# EAGLE design mic-preamp-stereo2 (EAGLE 6.2)
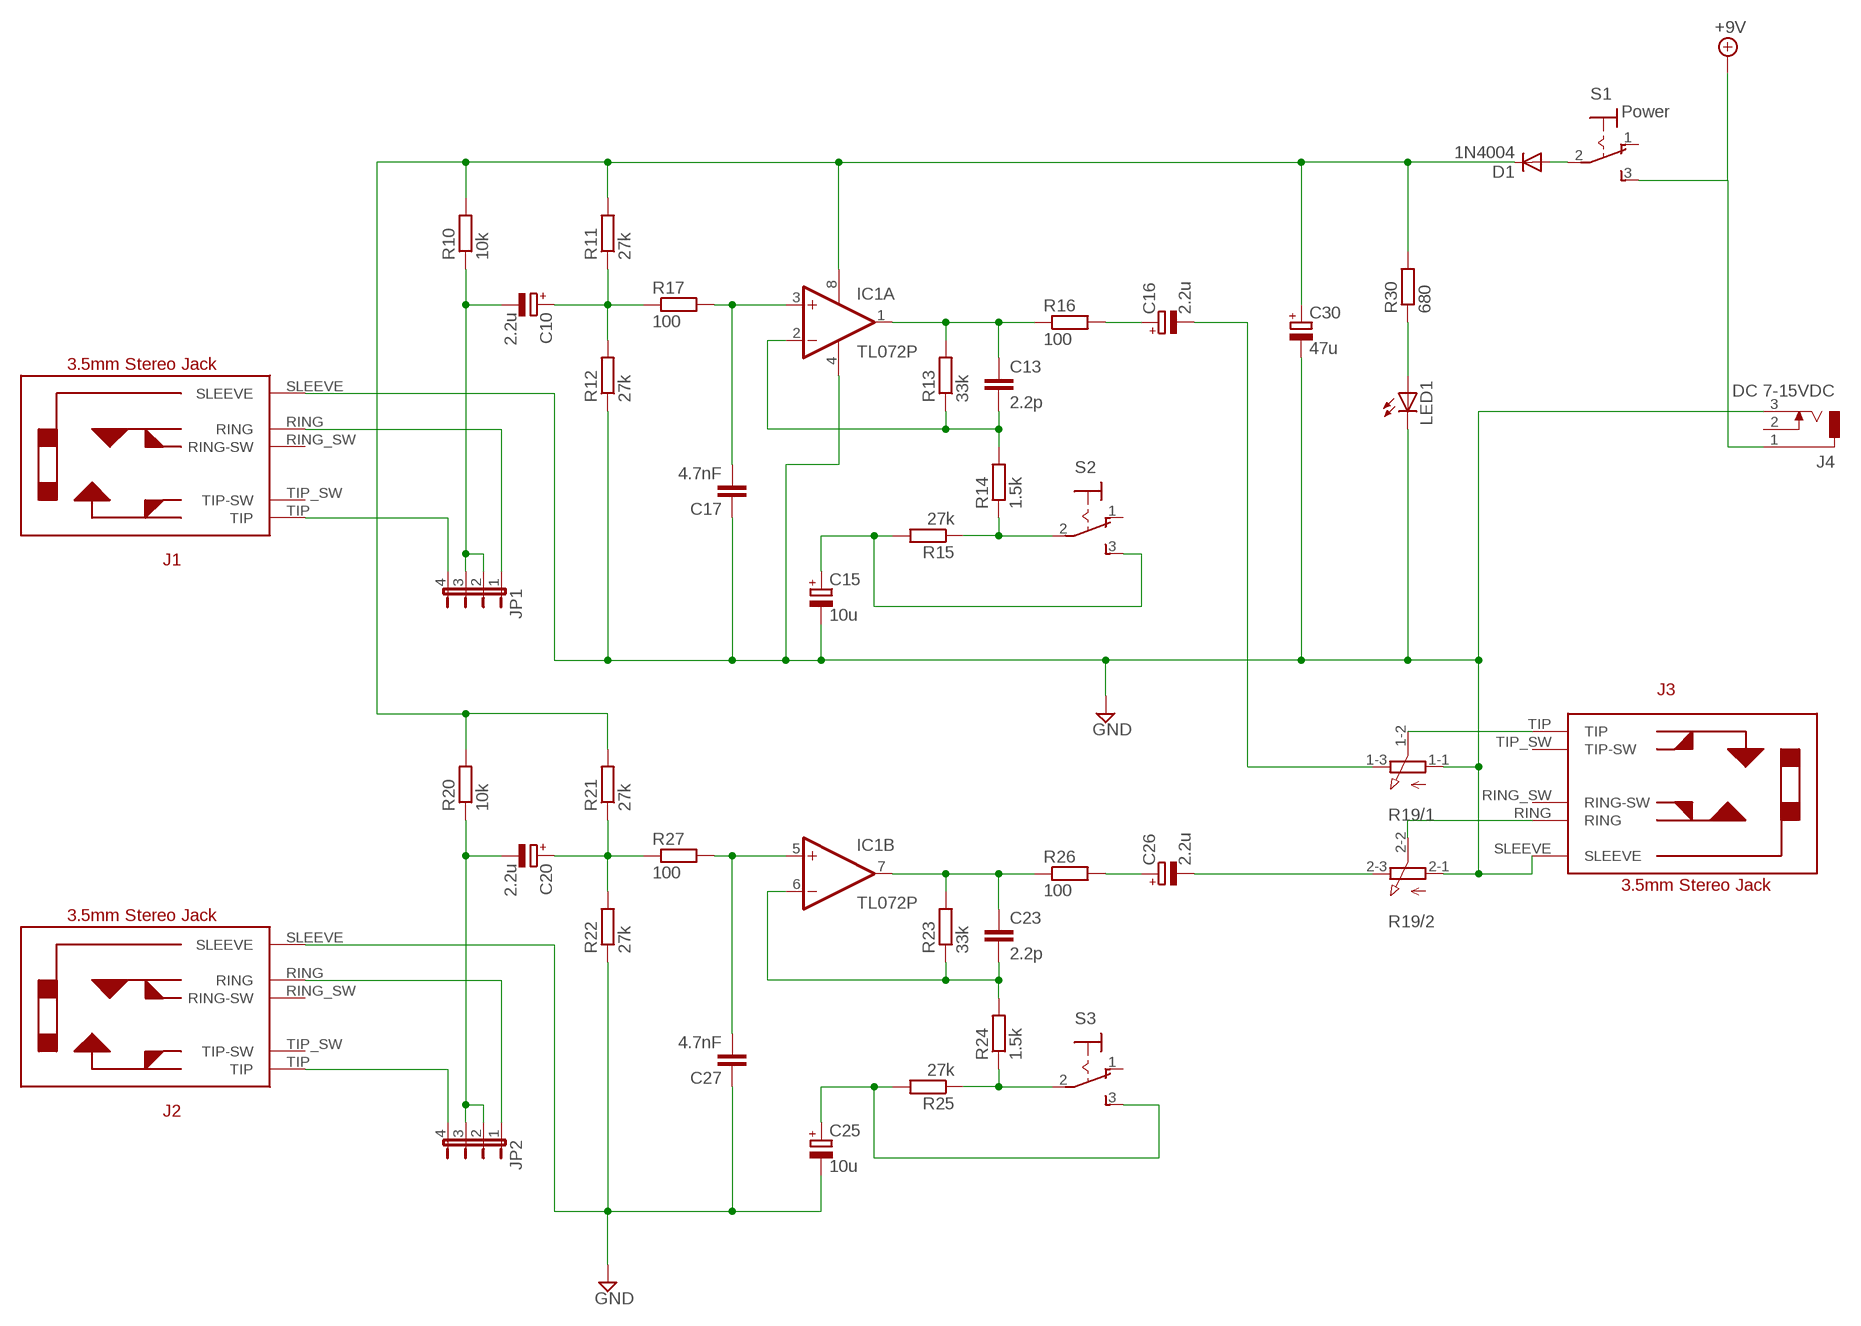
[diagram p0: schematic, sheet 1]

## Parts
C10  2.2u  CPOL-EUE2-5  [E2-5]
C13  2.2p  C-EU025-024X044  [C025-024X044]
C15  10u  CPOL-EUE2-5  [E2-5]
C16  2.2u  CPOL-EUE2-5  [E2-5]
C17  4.7nF  C-EU025-024X044  [C025-024X044]
C20  2.2u  CPOL-EUE2-5  [E2-5]
C23  2.2p  C-EU025-024X044  [C025-024X044]
C25  10u  CPOL-EUE2-5  [E2-5]
C26  2.2u  CPOL-EUE2-5  [E2-5]
C27  4.7nF  C-EU025-024X044  [C025-024X044]
C30  47u  CPOL-EUE2-5  [E2-5]
D1  1N4004  [DO41-10]
IC1  TL072P  [DIL08]
J1  PICAXE_STEREOJACKSOCKET  [PICAXE_STEREOJACKSOCKET]
J2  PICAXE_STEREOJACKSOCKET  [PICAXE_STEREOJACKSOCKET]
J3  Stereo Out  PICAXE_STEREOJACKSOCKET  [PICAXE_STEREOJACKSOCKET]
J4  DC 7-15VDC  DCJ0202  [DCJ0202]
JP1  JP4E  [JP4]
JP2  JP4E  [JP4]
LED1  LED5MM  [LED5MM]
R10  10k  R-EU_0207/5V  [0207/5V]
R11  27k  R-EU_0207/5V  [0207/5V]
R12  27k  R-EU_0207/5V  [0207/5V]
R13  33k  R-EU_0207/5V  [0207/5V]
R14  1.5k  R-EU_0207/5V  [0207/5V]
R15  27k  R-EU_0207/5V  [0207/5V]
R16  100  R-EU_0207/5V  [0207/5V]
R17  100  R-EU_0207/5V  [0207/5V]
R19  3RP/1610G  [3RP/1610G]
R20  10k  R-EU_0207/5V  [0207/5V]
R21  27k  R-EU_0207/5V  [0207/5V]
R22  27k  R-EU_0207/5V  [0207/5V]
R23  33k  R-EU_0207/5V  [0207/5V]
R24  1.5k  R-EU_0207/5V  [0207/5V]
R25  27k  R-EU_0207/5V  [0207/5V]
R26  100  R-EU_0207/5V  [0207/5V]
R27  100  R-EU_0207/5V  [0207/5V]
R30  680  R-EU_0207/12  [0207/12]
S1  Power  M9040P  [M9040P]
S2  M9040P  [M9040P]
S3  M9040P  [M9040P]

## Nets
+9V: J4.1 S1.3(S)
GND [Ground]: C15.- C17.1 C25.- C27.1 C30.- IC1.4(P:V-) J1.SLEEVE J2.SLEEVE J3.SLEEVE J4.3 LED1.K(C) R12.1 R19.1-1(/1:A) R19.2-1(/2:A) R22.1
N$1: C10.+ R11.1 R12.2 R17.1
N$2: C13.1 IC1.1(A:OUT) R13.2 R16.1
N$3: C13.2 IC1.2(A:-IN) R13.1 R14.2
N$4: C30.+ D1.C IC1.8(P:V+) R10.2 R11.2 R20.2 R21.2 R30.2
N$5: R14.1 R15.1 S2.2(P)
N$6: C16.+ R16.2
N$7: C10.- JP1.2 JP1.3 R10.1
N$8: D1.A S1.2(P)
N$9: C15.+ R15.2 S2.3(S)
N$10: C16.- R19.1-3(/1:E)
N$11: LED1.A R30.1
N$12: C20.+ R21.1 R22.2 R27.1
N$13: C26.- R19.2-3(/2:E)
N$14: J1.TIP JP1.4
N$15: J1.RING JP1.1
N$16: C23.1 IC1.7(B:OUT) R23.2 R26.1
N$17: C23.2 IC1.6(B:-IN) R23.1 R24.2
N$18: J3.RING R19.2-2(/2:S)
N$19: R24.1 R25.1 S3.2(P)
N$20: C26.+ R26.2
N$21: C20.- JP2.2 JP2.3 R20.1
N$22: C25.+ R25.2 S3.3(S)
N$23: J3.TIP R19.1-2(/1:S)
N$24: C17.2 IC1.3(A:+IN) R17.2
N$25: J2.TIP JP2.4
N$26: J2.RING JP2.1
N$27: C27.2 IC1.5(B:+IN) R27.2
Unconnected: J1.RING_SW(RING-SW) J1.TIP_SW(TIP-SW) J2.RING_SW(RING-SW) J2.TIP_SW(TIP-SW) J3.RING_SW(RING-SW) J3.TIP_SW(TIP-SW) J4.2 S1.1(O) S2.1(O) S3.1(O)

## Library data of the parts
C10 C15 C16 C20 C25 C26 C30 = rcl:CPOL-EU: POLARIZED CAPACITOR, European symbol
C13 C17 C23 C27 = rcl:C-EU: CAPACITOR, European symbol
D1 = diode:1N4004: DIODE general purpose rectifier, 1 A
IC1 = linear:TL072: OP AMP
J1-J3 = PICAXE_StereoJackSocket:PICAXE_STEREOJACKSOCKET
J4 = con-jack:DCJ0202: DC POWER JACK Source: DCJ0202.pdf; OC_FARNELL: unknown; OC_NEWARK: unknown
JP1 JP2 = jumper:JP4E: JUMPER
LED1 = led:LED: LED OSRAM: - CHIPLED LG R971, LG N971, LY N971, LG Q971, LY Q971, LO R971, LY R971 LH N974, LH R974 LS Q976, LO Q976, LY Q976 LO Q996 - Hyper CHIPLED LW Q18S LB Q993, LB Q99A, LB R99A - SideLED LS A670, LO A670, LY A670, LG A670, LP A670 LB A673, LV A673, LT A673, LW A673 LH A674 LY A675 LS A676, LA A676, LO A676, LY A676, LW A676 LS A679, LY A679, LG A679 - Hyper Micro SIDELED® LS Y876, LA Y876, LO Y876, LY Y876 LT Y87S - SmartLED LW L88C, LW L88S LB L89C, LB L89S, LG L890 LS L89K, LO L89K, LY L89K LS L896, LA L896, LO L896, LY L896 - TOPLED LS T670, LO T670, LY T670, LG T670, LP T670 LSG T670, LSP T670, LSY T670, LOP T670, LYG T670 LG T671, LOG T671, LSG T671 LB T673, LV T673, LT T673, LW T673 LH T674 LS T676, LA T676, LO T676, LY T676, LB T676, LH T676, LSB T676, LW T676 LB T67C, LV T67C, LT T67C, LS T67K, LO T67K, LY T67K, LW E67C LS E67B, LA E67B, LO E67B, LY E67B, LB E67C, LV E67C, LT E67C LW T67C LS T679, LY T679, LG T679 LS T770, LO T770, LY T770, LG T770, LP T770 LB T773, LV T773, LT T773, LW T773 LH T774 LS E675, LA E675, LY E675, LS T675 LS T776, LA T776, LO T776, LY T776, LB T776 LHGB T686 LT T68C, LB T68C - Hyper Mini TOPLED® LB M676 - Mini TOPLED Santana® LG M470 LS M47K, LO M47K, LY M47K Source: http://www.osram.convergy.de LUXEON: - LUMILED® LXK2-PW12-R00, LXK2-PW12-S00, LXK2-PW14-U00, LXK2-PW14-V00 LXK2-PM12-R00, LXK2-PM12-S00, LXK2-PM14-U00 LXK2-PE12-Q00, LXK2-PE12-R00, LXK2-PE12-S00, LXK2-PE14-T00, LXK2-PE14-U00 LXK2-PB12-K00, LXK2-PB12-L00, LXK2-PB12-M00, LXK2-PB14-N00, LXK2-PB14-P00, LXK2-PB14-Q00 LXK2-PR12-L00, LXK2-PR12-M00, LXK2-PR14-Q00, LXK2-PR14-R00 LXK2-PD12-Q00, LXK2-PD12-R00, LXK2-PD12-S00 LXK2-PH12-R00, LXK2-PH12-S00 LXK2-PL12-P00, LXK2-PL12-Q00, LXK2-PL12-R00 Source: www.luxeon.com KINGBRIGHT: KA-3528ASYC Source: www.kingbright.com
R10-R16 R20-R26 R30 = rcl:R-EU_: RESISTOR, European symbol
R17 R27 = resistor:R-EU_: RESISTOR, European symbol
R19 = pot:3RP/1610G: 16mm Potentiometer two level Source: http://www.alphapotentiometers.net/html/16mm_pot_2.html
S1-S3 = switch:M9040P: TOGGLE SWITCH Marquardt

## Net classes
0 default: width 0.381 mm
1 Ground: width 0.305 mm, clearance 0.229 mm

## Board
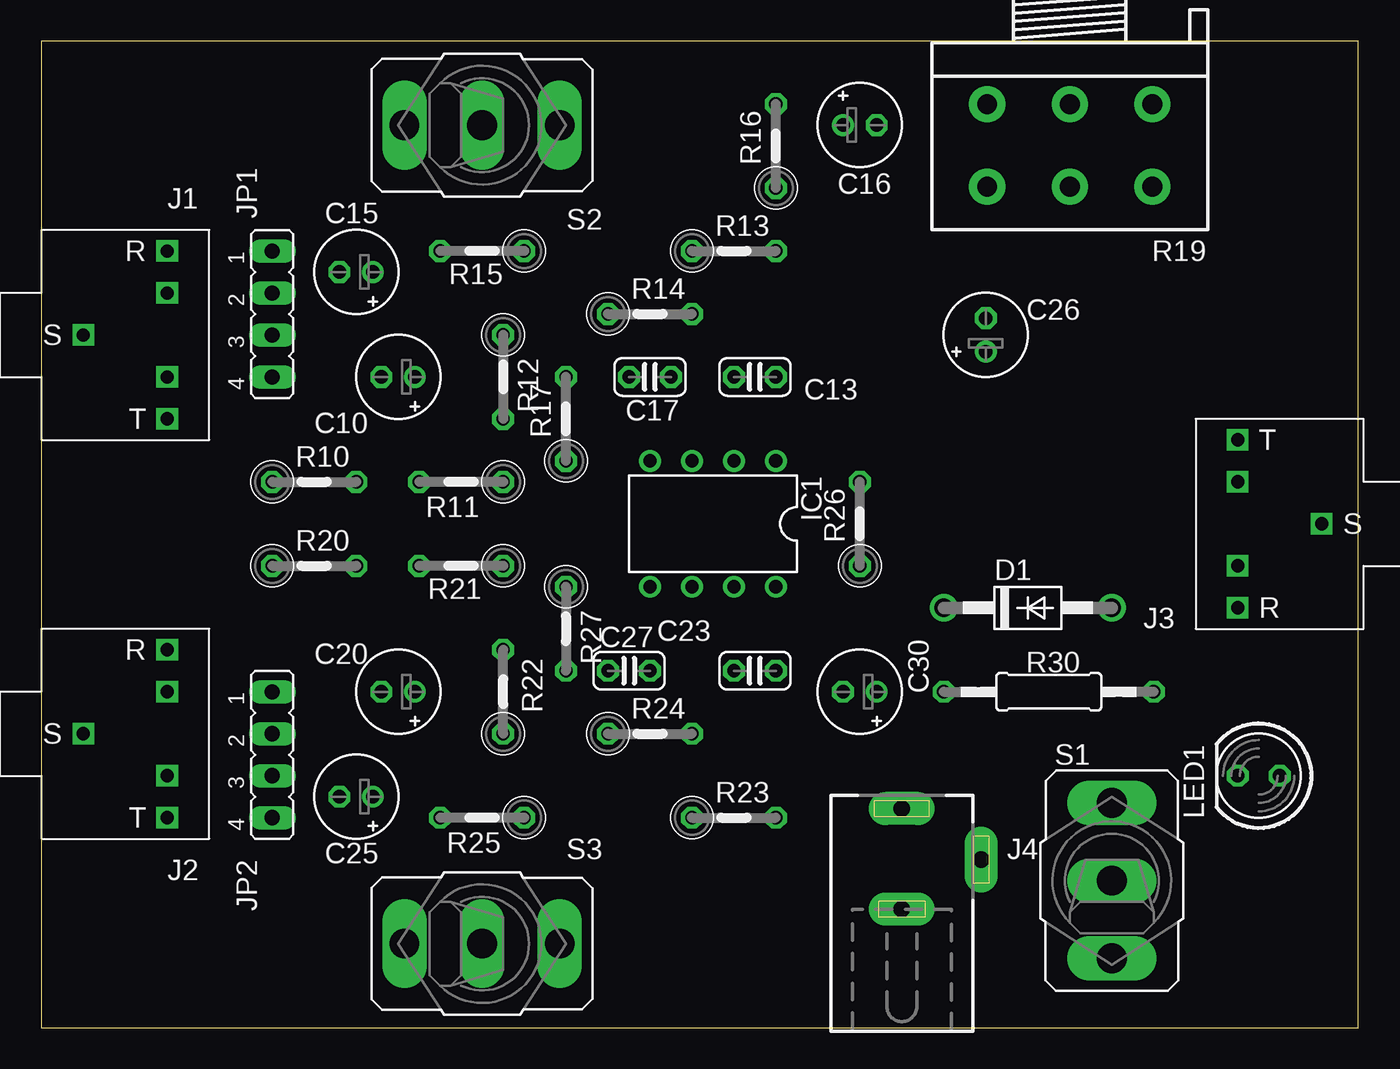
[diagram p1: board, top side]
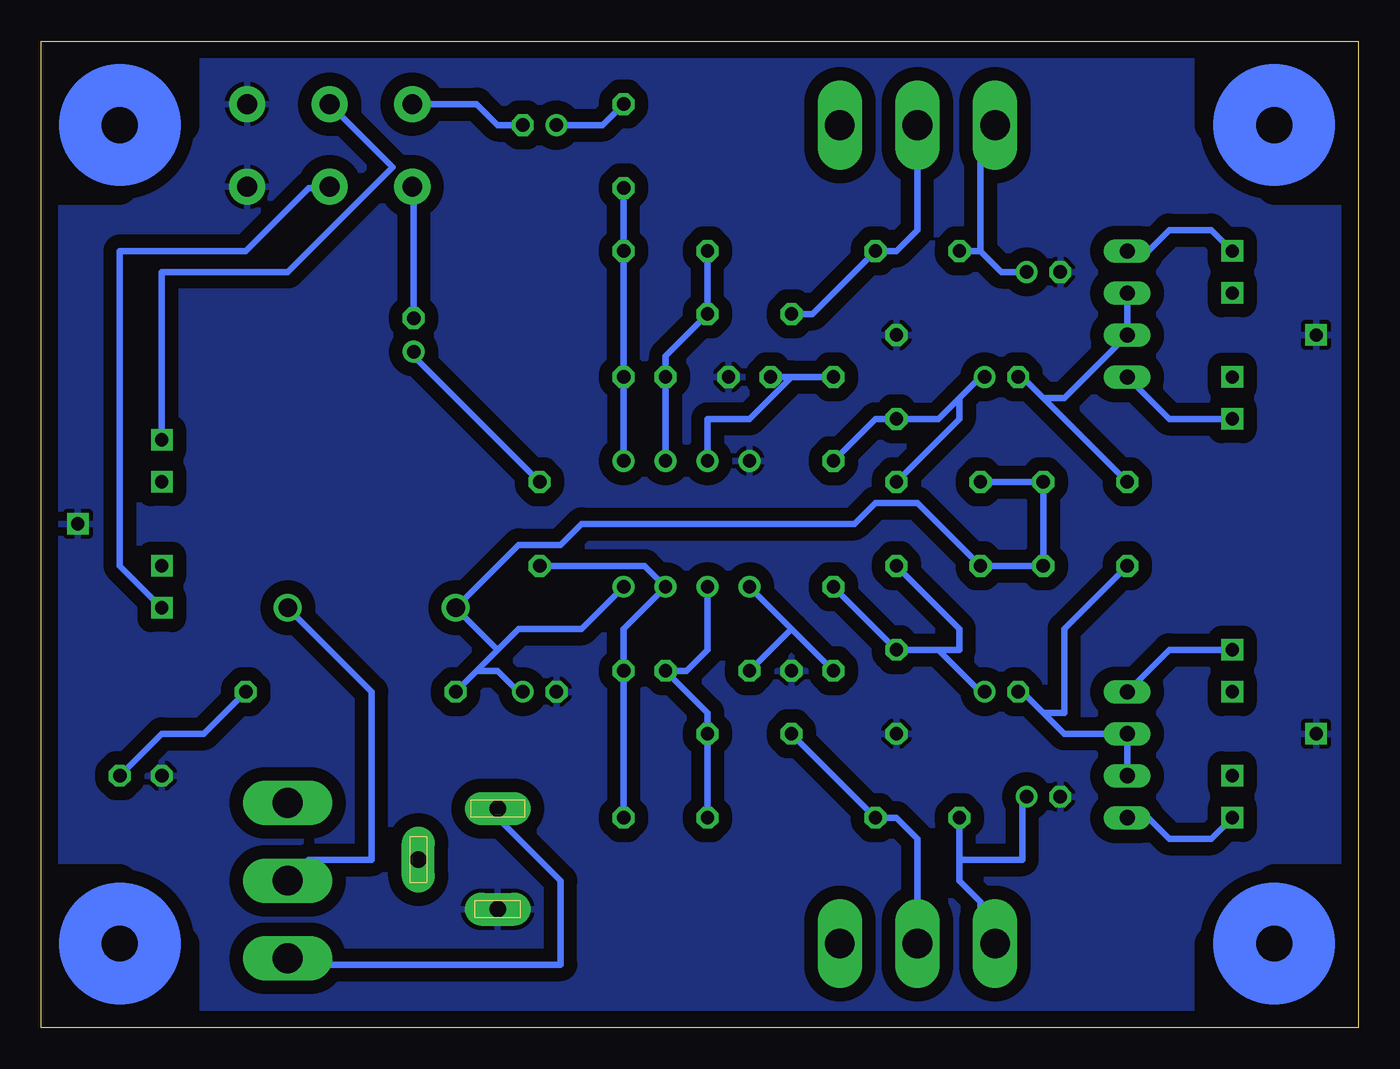
[diagram p2: board, bottom side, seen from below]

Size 79.68 x 59.68 mm. Coordinates in mm from the lower left corner, seen from the top.
Outline: 0,0 79.68,0 79.68,59.68 0,59.68 0,0
Copper layers 16: Bottom 0.035mm
Design rules: minimum track width 10mil, minimum drill 0.3mm, track to track 10mil, track to pad 10mil, pad to pad 10mil, via to via 10mil, smd to smd 10mil, copper to edge 40mil, drill to drill 8mil, minimum pad ring 10mil, minimum via ring 8mil, stop-mask expansion 8mil, vias tented up to drill 0mil, thermal gap 10mil
bRestrict: area 10.2,61 to 69.8,63.5; area 10.2,-3.8 to 69.8,-1.3; area -2.5,7.6 to -1.3,50.8; area -2.5,50.8 to 8.9,62.2; area 71.1,50.8 to 82.5,63.5; area 71.1,-2.5 to 82.5,8.9; area -2.5,-2.5 to 8.9,8.9

### Footprints (pad centres in the part's own frame; a part is rotated, then mirrored left to right if it is on the bottom)
E2-5 = drill 0.813 pad 1.27: + -1.016,0 | drill 0.813 pad 1.27 octagon: - 1.016,0
C025-024X044 = drill 0.813 octagon: 1 -1.27,0; 2 1.27,0
DO41-10 = drill 1.118: A 5.08,0; C -5.08,0
DIL08 = drill 0.813 pad 1.27: 1 -3.81,-3.81; 2 -1.27,-3.81; 3 1.27,-3.81; 4 3.81,-3.81; 5 3.81,3.81; 6 1.27,3.81; 7 -1.27,3.81; 8 -3.81,3.81
PICAXE_STEREOJACKSOCKET = drill 0.8 square: RING -5.08,-5.08; RING_SW -5.08,-2.54; SLEEVE 0,0; TIP -5.08,5.08; TIP_SW -5.08,2.54
DCJ0202 = drill 1 pad 2 long: 1 0,3.1; 2 4.8,0; 3 0,-3
JP4 = drill 0.914 long: 1 -3.81,0; 2 -1.27,0; 3 1.27,0; 4 3.81,0
LED5MM = drill 0.813 octagon: A -1.27,0; K 1.27,0
0207/5V = drill 0.813 octagon: 1 -2.54,0; 2 2.54,0
3RP/1610G = drill 1.2 pad 2.184: 1-1 -5,0; 1-2 0,0; 1-3 5,0; 2-1 -5,5; 2-2 0,5; 2-3 5,5
0207/12 = drill 0.813 octagon: 1 -6.35,0; 2 6.35,0
M9040P = drill 1.803 long: 1 0,4.699; 2 0,0; 3 0,-4.699

### Placement (x,y rotation side)
C10  21.59,39.37 180 top
C13  43.18,39.37 180 top
C15  19.05,45.72 180 top
C16  49.53,54.61 0 top
C17  36.83,39.37 180 top
C20  21.59,20.32 180 top
C23  43.18,21.59 180 top
C25  19.05,13.97 180 top
C26  57.15,41.91 90 top
C27  35.56,21.59 0 top
C30  49.53,20.32 180 top
D1  59.69,25.4 0 top
IC1  40.64,30.48 180 top
J1  2.54,41.91 180 top
J2  2.54,17.78 180 top
J3  77.47,30.48 0 top
J4  52.07,10.16 0 top
JP1  13.97,43.18 270 top
JP2  13.97,16.51 270 top
LED1  73.66,15.24 180 top
R10  16.51,33.02 0 top
R11  25.4,33.02 180 top
R12  27.94,39.37 270 top
R13  41.91,46.99 0 top
R14  36.83,43.18 0 top
R15  26.67,46.99 180 top
R16  44.45,53.34 90 top
R17  31.75,36.83 90 top
R19  62.23,55.88 180 top
R20  16.51,27.94 0 top
R21  25.4,27.94 180 top
R22  27.94,20.32 90 top
R23  41.91,12.7 0 top
R24  36.83,17.78 0 top
R25  26.67,12.7 180 top
R26  49.53,30.48 90 top
R27  31.75,24.13 270 top
R30  60.96,20.32 180 top
S1  64.77,8.89 0 top
S2  26.67,54.61 270 top
S3  26.67,5.08 270 top

### Tracks (layer width: path | path; a pad name or v marks a point on that pad's centre or on a via)
+9V
  Bottom 0.381: J4.1 52.07,12.7 48.26,8.89 48.26,3.81 64.77,3.81 S1.3
GND
  pour Bottom (isolate 0.813): 0,59.69 80.01,59.69 80.01,0 0,0
N$1
  Bottom 0.381: 24.13,38.1 25.4,36.83 R12.2 29.21,36.83 R17.1 | 24.13,38.1 22.86,39.37 C10.+ | R11.1 24.13,36.83 24.13,38.1
N$2
  Bottom 0.381: IC1.1 C13.1 R13.2 R16.1
N$3
  Bottom 0.381: IC1.2 C13.2 41.91,40.64 R14.2 R13.1
N$4
  Bottom 0.381: R11.2 R10.2 R20.2 R21.2 26.67,31.75 29.21,31.75 30.48,30.48 46.99,30.48 48.26,29.21 50.8,29.21 D1.C 52.07,22.86 | 53.34,21.59 52.07,21.59 50.8,20.32 C30.+ | R30.2 53.34,21.59 | IC1.8 46.99,24.13 50.8,24.13 52.07,22.86 | 53.34,21.59 52.07,22.86
N$5
  Bottom 0.381: R14.1 33.02,43.18 R15.1 27.94,46.99 26.67,48.26 S2.2
N$6
  Bottom 0.381: R16.2 45.72,54.61 C16.+
N$7
  Bottom 0.381: JP1.2 JP1.3 17.78,38.1 19.05,38.1 | 19.05,38.1 20.32,39.37 C10.- | 19.05,38.1 R10.1
N$8
  Bottom 0.381: D1.A 59.69,20.32 59.69,10.16 63.5,10.16 S1.2
N$9
  Bottom 0.381: C15.+ 21.59,45.72 22.86,46.99 | R15.2 22.86,46.99 | 22.86,46.99 22.86,54.61 S2.3
N$10
  Bottom 0.381: C16.- 52.07,54.61 53.34,55.88 R19.1-3
N$11
  Bottom 0.381: R30.1 69.85,17.78 72.39,17.78 LED1.A
N$12
  Bottom 0.381: 25.4,22.86 22.86,20.32 C20.+ | 25.4,22.86 R22.2 R27.1 | R21.1 24.13,24.13 24.13,22.86 25.4,22.86
N$13
  Bottom 0.381: C26.- 57.15,50.8 R19.2-3
N$14
  Bottom 0.381: J1.TIP 11.43,36.83 JP1.4
N$15
  Bottom 0.381: J1.RING 8.89,48.26 11.43,48.26 12.7,46.99 JP1.1
N$16
  Bottom 0.381: R23.2 C23.1 44.45,24.13 IC1.7 43.18,27.94 R26.1
N$17
  Bottom 0.381: R23.1 R24.2 39.37,19.05 C23.2 40.64,21.59 39.37,22.86 IC1.6
N$18
  Bottom 0.381: J3.RING 74.93,27.94 74.93,46.99 67.31,46.99 63.5,50.8 62.23,50.8 R19.2-2
N$19
  Bottom 0.381: R24.1 R25.1 27.94,12.7 26.67,11.43 S3.2
N$20
  Bottom 0.381: R26.2 57.15,40.64 C26.+
N$21
  Bottom 0.381: 19.05,19.05 17.78,17.78 JP2.2 JP2.3 | 19.05,19.05 20.32,20.32 C20.- | R20.1 17.78,24.13 17.78,19.05 19.05,19.05
N$22
  Bottom 0.381: 24.13,10.16 24.13,8.89 22.86,7.62 22.86,5.08 S3.3 | 24.13,10.16 R25.2 | 24.13,10.16 20.32,10.16 20.32,13.97 C25.+
N$23
  Bottom 0.381: J3.TIP 72.39,45.72 64.77,45.72 58.42,52.07 R19.1-2
N$24
  Bottom 0.381: C17.2 34.29,39.37 | 34.29,39.37 R17.2 | IC1.3 39.37,36.83 36.83,36.83 34.29,39.37
N$25
  Bottom 0.381: J2.TIP 8.89,11.43 11.43,11.43 12.7,12.7 JP2.4
N$26
  Bottom 0.381: J2.RING 11.43,22.86 JP2.1
N$27
  Bottom 0.381: IC1.5 34.29,24.13 | 34.29,24.13 R27.2 | 34.29,24.13 C27.2
(copper drawn outside any net)
  shapes: Bottom circle x12

### Text on the board
tValues: Ⓛ | Gain | Ⓛ in | Ⓡ in | Stereo Out | (+) core | - | Ⓡ | + | Gain